# Altium schematic sheet Schematic.SchDoc
size A
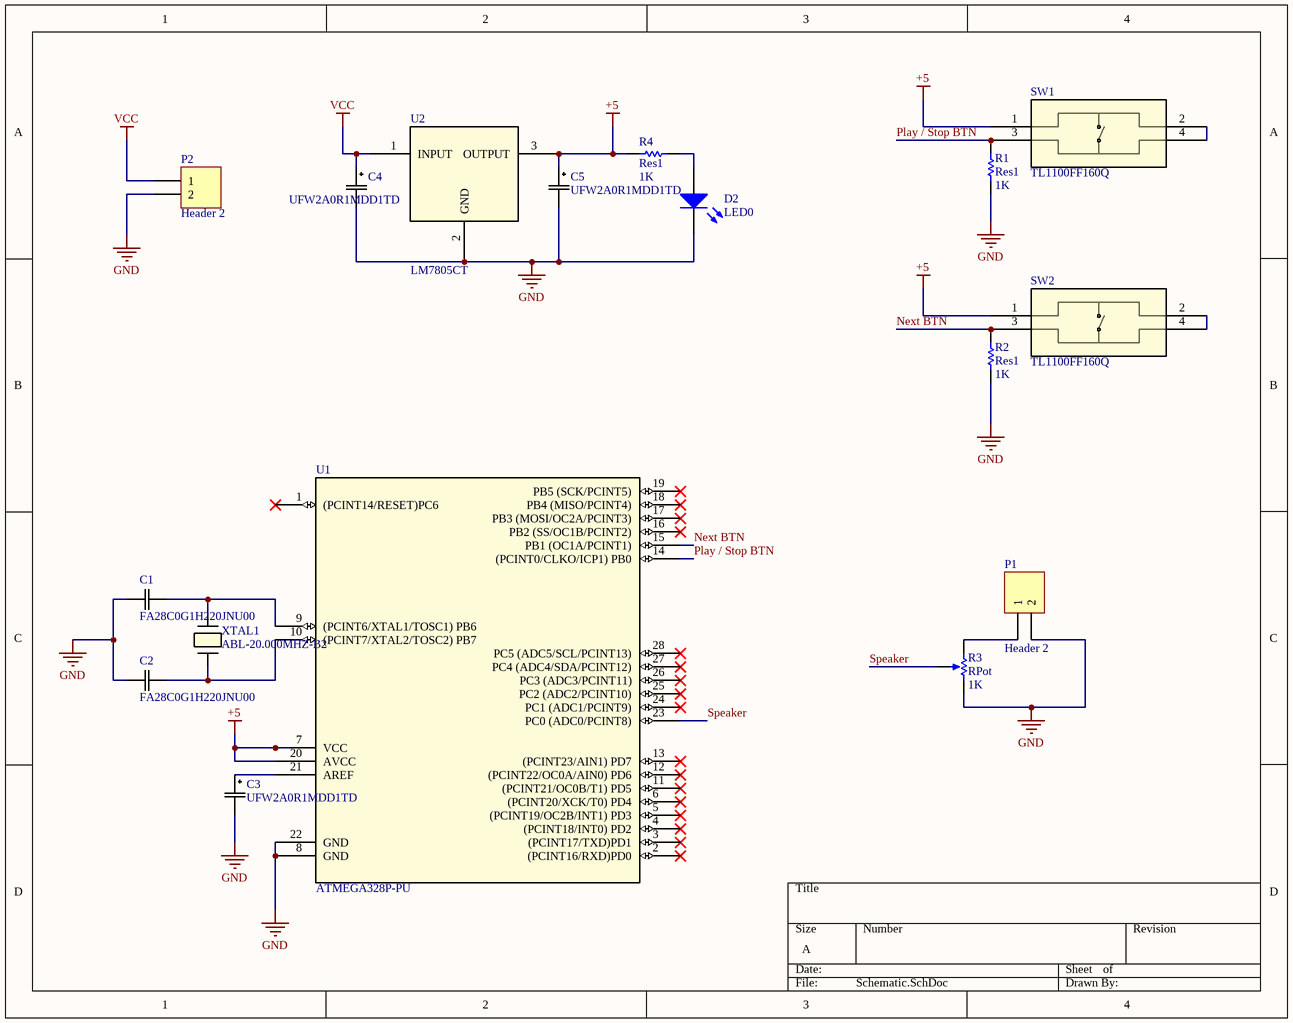
[diagram p0: Schematic.SchDoc]

## Parts
C1  FA28C0G1H220JNU00  [CAP_FA28_TDK]
C2  FA28C0G1H220JNU00  [CAP_FA28_TDK]
C3  UFW2A0R1MDD1TD  [CAP_UEP_5X11_NCH]
C4  UFW2A0R1MDD1TD  [CAP_UEP_5X11_NCH]
C5  UFW2A0R1MDD1TD  [CAP_UEP_5X11_NCH]
D2  LED0  [LED-0]
P1  Header 2  [HDR1X2]
P2  Header 2  [HDR1X2]
R1  Res1  value 1K  [AXIAL-0.3]
R2  Res1  value 1K  [AXIAL-0.3]
R3  RPot  value 1K  [VR5]
R4  Res1  value 1K  [AXIAL-0.3]
SW1  TL1100FF160Q  [TL1100F]
SW2  TL1100FF160Q  [TL1100F]
U1  ATMEGA328P-PU  [28P3_ATM]
U2  LM7805CT  [TO-220_FAS]
XTAL1  ABL-20.000MHZ-B2  [XTAL_ABL_ABR]

## Nets
+5: C5.1 R4.1 SW1.1 SW2.1 U1.7(VCC) U1.20(AVCC) U2.3(OUTPUT)
GND: C1.1 C2.1 C3.2 C4.2 C5.2 D2.2(K) P1.2 P2.2 R1.1 R2.2 R3.2(BOT) U1.8(GND) U1.22(GND) U2.2(GND)
VCC: C4.1 P2.1 U2.1(INPUT)
Next BTN: R2.1 SW2.3 U1.15(PB1_(OC1A/PCINT1))
Play / Stop BTN: R1.2 SW1.3 U1.14((PCINT0/CLKO/ICP1)_PB0)
Speaker: R3.3(TAP) U1.23(PC0_(ADC0/PCINT8))
NetC1_2: C1.2 U1.9((PCINT6/XTAL1/TOSC1)_PB6) XTAL1.2
NetC2_2: C2.2 U1.10((PCINT7/XTAL2/TOSC2)_PB7) XTAL1.1
NetC3_1: C3.1 U1.21(AREF)
NetD2_1: D2.1(A) R4.2
NetP1_1: P1.1 R3.1(TOP)
NetSW1_2: SW1.2 SW1.4
NetSW2_2: SW2.2 SW2.4

Not connected (* = marked no-connect by the designer): U1 1((PCINT14/RESET)PC6)* 2((PCINT16/RXD)PD0)* 3((PCINT17/TXD)PD1)* 4((PCINT18/INT0)_PD2)* 5((PCINT19/OC2B/INT1)_PD3)* 6((PCINT20/XCK/T0)_PD4)* 11((PCINT21/OC0B/T1)_PD5)* 12((PCINT22/OC0A/AIN0)_PD6)* 13((PCINT23/AIN1)_PD7)* 16(PB2_(SS/OC1B/PCINT2))* 17(PB3_(MOSI/OC2A/PCINT3))* 18(PB4_(MISO/PCINT4))* 19(PB5_(SCK/PCINT5))* 24(PC1_(ADC1/PCINT9))* 25(PC2_(ADC2/PCINT10))* 26(PC3_(ADC3/PCINT11))* 27(PC4_(ADC4/SDA/PCINT12))* 28(PC5_(ADC5/SCL/PCINT13))*

## Library data of the parts
C1 C2 = FA28C0G1H220JNU00: No Description Available; Built_By: EMA_Matt; Vendor: TDK; SourceLibrary: TDK_2019-10-09; Type: DEV; Copyright: Copyright (C) 2018 Accelerated Designs. All rights reserved; Manufacturer_Part_Number: FA28C0G1H220JNU00; RefDes: RefDes
C3-C5 = UFW2A0R1MDD1TD: No Description Available; Vendor: Nichicon; Built_By: EMA_Cory; SourceLibrary: Nichicon_2019-09-13; Type: DEV; Manufacturer_Part_Number: UFW2A0R1MDD1TD; Copyright: Copyright (C) 2018 Accelerated Designs. All rights reserved; RefDes: RefDes
D2 = LED0: Typical INFRARED GaAs LED; Published: 8-Jun-2000; LatestRevisionDate: 08-Jul-2005; LatestRevisionNote: Mech Layer 1 removed.; PackageReference: LED-0; Publisher: Altium Limited; PackageDescription: LED; 2 Leads
P1 P2 = Header 2: Header, 2-Pin; LatestRevisionDate: 17-Jul-2002; LatestRevisionNote: Re-released for DXP Platform.; Publisher: Altium Limited
R1 R2 R4 = Res1: Resistor; Published: 8-Jun-2000; LatestRevisionDate: 17-Jul-2002; LatestRevisionNote: Re-released for DXP Platform.; PackageReference: AXIAL-0.3; Publisher: Altium Limited; PackageDescription: Axial Device, Thru-Hole; 2 Leads; 0.3 in Pin Spacing
R3 = RPot: Potentiometer; Sim Note: Enter the Resistance value and the set point into parameter fields.; Set Position: 0.5; Published: 8-Jun-2000; LatestRevisionDate: 17-Jul-2002; LatestRevisionNote: Re-released for DXP Platform.; PackageReference: VR5; Publisher: Altium Limited; PackageDescription: Variable Resistor, Thru-Hole; 3 Leads
SW1 SW2 = TL1100FF160Q: No Description Available; Vendor: E-Switch; Built_By: EMA_Cory; SourceLibrary: E-Switch_2020-03-31; Datasheet: https://sten-eswitch-13110800-production.s3.amazonaws.com/system/asset/product_line/data_sheet/143/TL1100.pdf; Manufacturer_Part_Number: TL1100FF160Q; Copyright: Copyright (C) 2018 Accelerated Designs. All rights reserved; RefDes: RefDes; Type: DEV
U1 = ATMEGA328P-PU: No Description Available; Built_By: EMA_UL_Team; Vendor: Atmel; SourceLibrary: Atmel_2011-04-02; Manufacturer_Part_Number: ATMEGA328P-PU; Copyright: Copyright (C) 2018 Accelerated Designs. All rights reserved; RefDes: RefDes; Type: DEV
U2 = LM7805CT: No Description Available; Vendor: Fairchild Semiconductor; Built_By: EMA_UL_Team; SourceLibrary: Fairchild_2008-01-01_; Manufacturer_Part_Number: LM7805CT; Copyright: Copyright (C) 2018 Accelerated Designs. All rights reserved; RefDes: RefDes; Type: DEV
XTAL1 = ABL-20.000MHZ-B2: No Description Available; Vendor: Abracon; Built_By: EMA_Cory; SourceLibrary: Add_to_database_2020-12-08; Datasheet: https://abracon.com/Resonators/ABL.pdf; Manufacturer_Part_Number: ABL-20.000MHZ-B2; Copyright: Copyright (C) 2018 Accelerated Designs. All rights reserved; RefDes: RefDes; Type: DEV